# Altium project ATRACK_HOST_V1.PrjPCB
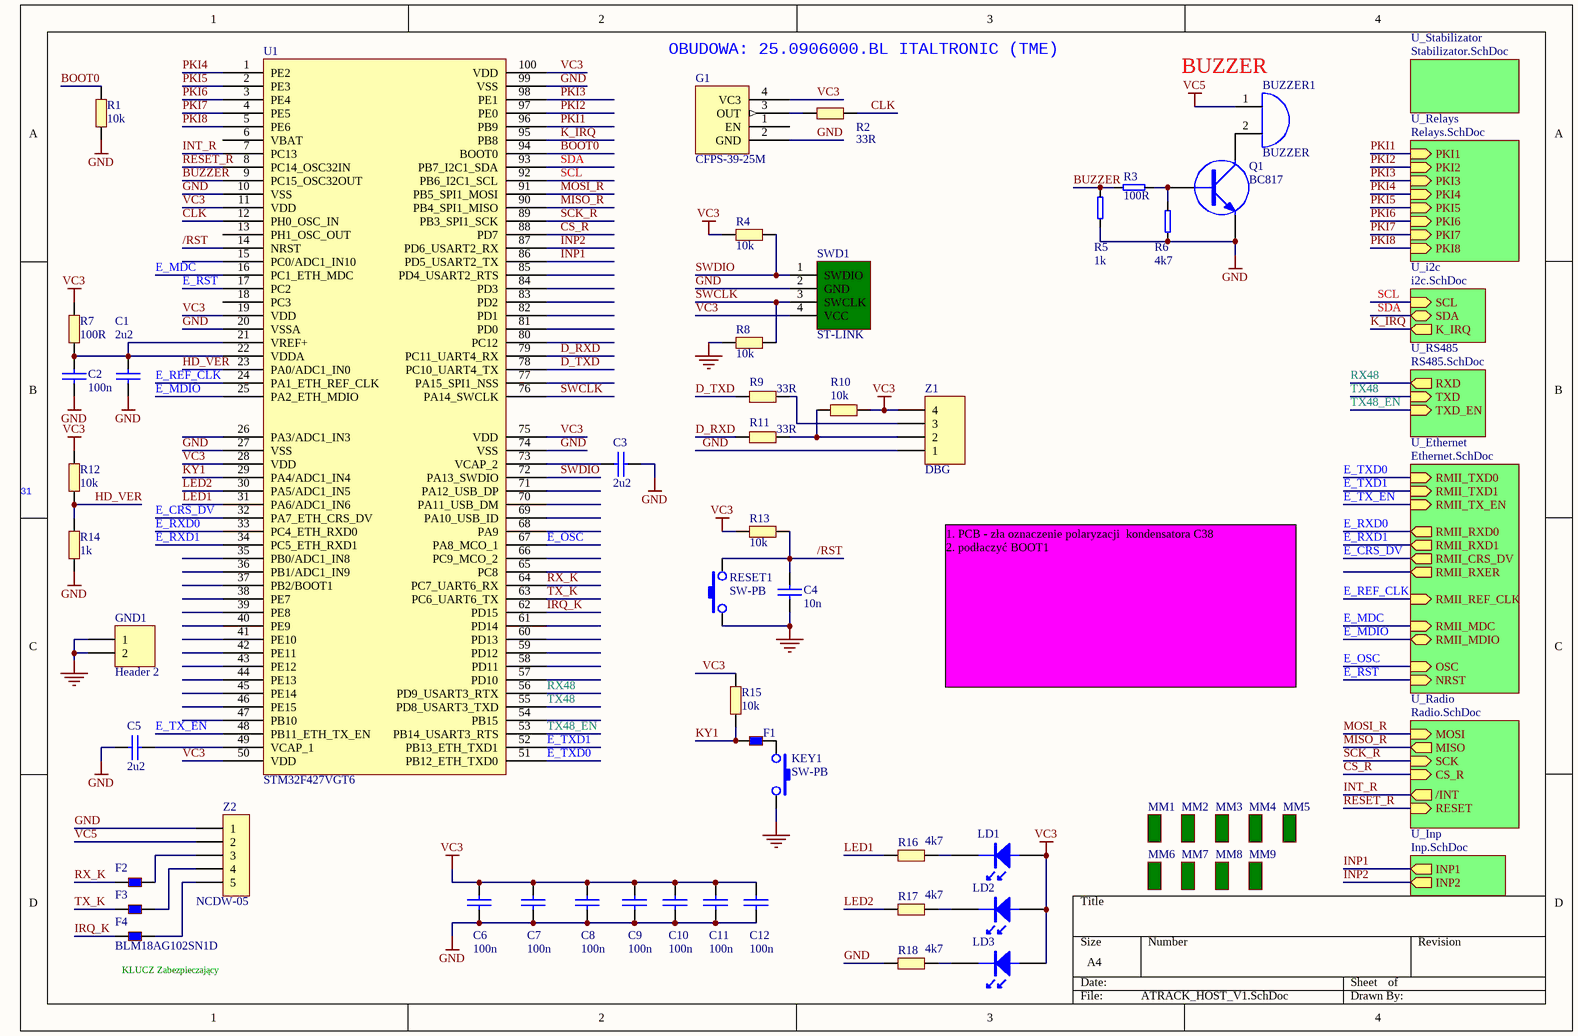
[diagram p0: ATRACK_HOST_V1.SchDoc]
8 sheets, 274 parts. Net scope: hierarchical (ports join the sheet entries above them; power ports are global).
Board file: ATRACK_HOST_V1.PcbDoc
Sheets:
  ATRACK_HOST_V1.SchDoc
    U_Stabilizator = Stabilizator.SchDoc
    U_Ethernet = Ethernet.SchDoc
    U_i2c = i2c.SchDoc
    U_Relays = Relays.SchDoc
    U_RS485 = RS485.SchDoc
    U_Radio = Radio.SchDoc
    U_Inp = Inp.SchDoc

## Sheet ATRACK_HOST_V1.SchDoc
size A4

### Parts
BUZZER1  BUZZER  [BMT-1205H09B]
C1  2u2  [0603C]
C2  100n  [0603C]
C3  2u2  [0603C]
C4  10n  [0603C]
C5  2u2  [0603C]
C6  100n  [0603C]
C7  100n  [0603C]
C8  100n  [0603C]
C9  100n  [0603C]
C10  100n  [0603C]
C11  100n  [0603C]
C12  100n  [0603C]
F1  BLM18BB141SN1D  [0603L]  (value not drawn)
F2  BLM18AG102SN1D  [0603L]  (value not drawn)
F3  BLM18AG102SN1D  [0603L]  (value not drawn)
F4  BLM18AG102SN1D  [0603L]
G1  CFPS-39-25M  [GEN_SMD1_1]
GND1  Header 2  [HDR1X2]
KEY1  SW-PB  [DTSM31N_2]
LD1  (no value)  [0805LG]
LD2  (no value)  [0805LR]
LD3  (no value)  [0805LG]
MM1  (no value)  [REF_CIR]
MM2  (no value)  [REF_CIR]
MM3  (no value)  [REF_SQR]
MM4  (no value)  [REF_SQR]
MM5  (no value)  [PB_FREE_GRAF]
MM6  (no value)  [REF_CIR]
MM7  (no value)  [REF_CIR]
MM8  (no value)  [REF_SQR]
MM9  (no value)  [REF_SQR]
Q1  BC817  [SOT23-3Q]
R1  10k  [0603R]
R2  33R  [0603R]
R3  100R  [0603R]
R4  10k  [0603R]
R5  1k  [0603R]
R6  4k7  [0603R]
R7  100R  [0603R]
R8  10k  [0603R]
R9  33R  [0603R]
R10  10k  [0603R]
R11  33R  [0603R]
R12  10k  [0603R]
R13  10k  [0603R]
R14  1k  [0603R]
R15  10k  [0603R]
R16  4k7  [0603R]
R17  4k7  [0603R]
R18  4k7  [0603R]
RESET1  SW-PB  [DTSM31N_2]
SWD1  ST-LINK  [PIN4]
U1  STM32F427VGT6  [VQ100_2]
Z1  DBG  [PIN4]
Z2  NCDW-05  [KEY_LOG]

### Sub-sheets
U_Ethernet = Ethernet.SchDoc: RMII_TXD0 (in), RMII_TX_EN (in), RMII_RXD0 (out), RMII_REF_CLK (in), RMII_CRS_DV (out), RMII_MDC (in), RMII_MDIO (bidir), NRST (in), RMII_TXD1 (in), RMII_RXD1 (out), RMII_RXER (out), OSC (in)
U_i2c = i2c.SchDoc: SCL (in), SDA (bidir), K_IRQ (out)
U_Inp = Inp.SchDoc: INP1 (out), INP2 (out)
U_Radio = Radio.SchDoc: CS_R (in), MOSI (in), MISO (out), SCK (in), RESET (in), /INT (out)
U_Relays = Relays.SchDoc: PKI1 (in), PKI2 (in), PKI3 (in), PKI4 (in), PKI5 (in), PKI6 (in), PKI7 (in), PKI8 (in)
U_RS485 = RS485.SchDoc: TXD (in), TXD_EN (in), RXD (out)
U_Stabilizator = Stabilizator.SchDoc: no entries

### Nets
GND: C1.2 C2.2 C3.1 C4.2 C5.1 C6.2 C7.2 C8.2 C9.2 C10.2 C11.2 C12.2 G1.2(GND) GND1.1 GND1.2 KEY1.2 Q1.E R1.2 R5.2 R6.2 R8.1 R14.1 R18.2 RESET1.1 SWD1.2(GND) U1.10(VSS) U1.20(VSSA) U1.27(VSS) U1.74(VSS) U1.99(VSS) Z1.1 Z2.1
VC3: C6.1 C7.1 C8.1 C9.1 C10.1 C11.1 C12.1 G1.4(VC3) LD1.A LD2.A LD3.A R4.1 R7.2 R10.2 R12.2 R13.1 R15.2 SWD1.4(VCC) U1.11(VDD) U1.19(VDD) U1.28(VDD) U1.50(VDD) U1.75(VDD) U1.100(VDD) Z1.4
VC5: BUZZER1.1 Z2.2
/RST: C4.1 R13.2 RESET1.2 U1.14(NRST)
BOOT0: R1.1 U1.94(BOOT0)
BUZZER: R3.2 R5.1 U1.9(PC15_OSC32OUT)
CLK: R2.2 U1.12(PH0_OSC_IN)
CS_R: U1.88(PD7) ; sheet U_Radio/CS_R
D_RXD: R11.2 U1.79(PC11_UART4_RX)
D_TXD: R9.2 U1.78(PC10_UART4_TX)
E_CRS_DV: U1.32(PA7_ETH_CRS_DV) ; sheet U_Ethernet/RMII_CRS_DV
E_MDC: U1.16(PC1_ETH_MDC) ; sheet U_Ethernet/RMII_MDC
E_MDIO: U1.25(PA2_ETH_MDIO) ; sheet U_Ethernet/RMII_MDIO
E_OSC: U1.67(PA8_MCO_1) ; sheet U_Ethernet/OSC
E_REF_CLK: U1.24(PA1_ETH_REF_CLK) ; sheet U_Ethernet/RMII_REF_CLK
E_RST: U1.17(PC2) ; sheet U_Ethernet/NRST
E_RXD0: U1.33(PC4_ETH_RXD0) ; sheet U_Ethernet/RMII_RXD0
E_RXD1: U1.34(PC5_ETH_RXD1) ; sheet U_Ethernet/RMII_RXD1
E_TX_EN: U1.48(PB11_ETH_TX_EN) ; sheet U_Ethernet/RMII_TX_EN
E_TXD0: U1.51(PB12_ETH_TXD0) ; sheet U_Ethernet/RMII_TXD0
E_TXD1: U1.52(PB13_ETH_TXD1) ; sheet U_Ethernet/RMII_TXD1
HD_VER: R12.1 R14.2 U1.23(PA0/ADC1_IN0)
INP1: U1.86(PD5_USART2_TX) ; sheet U_Inp/INP1
INP2: U1.87(PD6_USART2_RX) ; sheet U_Inp/INP2
INT_R: U1.7(PC13) ; sheet U_Radio//INT
IRQ_K: F4.1 U1.62(PD15)
K_IRQ: U1.95(PB8) ; sheet U_i2c/K_IRQ
KY1: F1.2 R15.1 U1.29(PA4/ADC1_IN4)
LED1: R16.2 U1.31(PA6/ADC1_IN6)
LED2: R17.2 U1.30(PA5/ADC1_IN5)
MISO_R: U1.90(PB4_SPI1_MISO) ; sheet U_Radio/MISO
MOSI_R: U1.91(PB5_SPI1_MOSI) ; sheet U_Radio/MOSI
PKI1: U1.96(PB9) ; sheet U_Relays/PKI1  [project net PK1_1]
PKI2: U1.97(PE0) ; sheet U_Relays/PKI2  [project net PK2_1]
PKI3: U1.98(PE1) ; sheet U_Relays/PKI3  [project net PK3_1]
PKI4: U1.1(PE2) ; sheet U_Relays/PKI4  [project net PK4_1]
PKI5: U1.2(PE3) ; sheet U_Relays/PKI5  [project net PK5_1]
PKI6: U1.3(PE4) ; sheet U_Relays/PKI6  [project net PK6_1]
PKI7: U1.4(PE5) ; sheet U_Relays/PKI7  [project net PK7_1]
PKI8: U1.5(PE6) ; sheet U_Relays/PKI8  [project net PK8_1]
RESET_R: U1.8(PC14_OSC32IN) ; sheet U_Radio/RESET
RX48: U1.56(PD9_USART3_RTX) ; sheet U_RS485/RXD
RX_K: F2.1 U1.64(PC7_UART6_RX)
SCK_R: U1.89(PB3_SPI1_SCK) ; sheet U_Radio/SCK
SCL: U1.92(PB6_I2C1_SCL) ; sheet U_i2c/SCL
SDA: U1.93(PB7_I2C1_SDA) ; sheet U_i2c/SDA
SWCLK: R8.2 SWD1.3(SWCLK) U1.76(PA14_SWCLK)
SWDIO: R4.2 SWD1.1(SWDIO) U1.72(PA13_SWDIO)
TX48: U1.55(PD8_USART3_TXD) ; sheet U_RS485/TXD
TX48_EN: U1.53(PB14_USART3_RTS) ; sheet U_RS485/TXD_EN
TX_K: F3.1 U1.63(PC6_UART6_TX)
NetBUZZER1_2: BUZZER1.2 Q1.C
NetC1_1: C1.1 C2.1 R7.1 U1.21(VREF+) U1.22(VDDA)
NetC3_2: C3.2 U1.73(VCAP_2)
NetC5_2: C5.2 U1.49(VCAP_1)
NetF1_1: F1.1 KEY1.1
NetF2_2: F2.2 Z2.3
NetF3_2: F3.2 Z2.4
NetF4_2: F4.2 Z2.5
NetG1_3: G1.3(OUT) R2.1
NetLD1_K: LD1.K R16.1
NetLD2_K: LD2.K R17.1
NetLD3_K: LD3.K R18.1
NetQ1_B: Q1.B R3.1 R6.1
NetR9_1: R9.1 Z1.3
NetR10_1: R10.1 R11.1 Z1.2

Not connected (* = marked no-connect by the designer): G1 1(EN); U1 6(VBAT) 13(PH1_OSC_OUT) 15(PC0/ADC1_IN10) 18(PC3) 26(PA3/ADC1_IN3) 35(PB0/ADC1_IN8) 36(PB1/ADC1_IN9) 37(PB2/BOOT1) 38(PE7) 39(PE8) 40(PE9) 41(PE10) 42(PE11) 43(PE12) 44(PE13) 45(PE14) 46(PE15) 47(PB10) 54(PB15) 57(PD10) 58(PD11) 59(PD12) 60(PD13) 61(PD14) 65(PC8) 66(PC9_MCO_2) 68(PA9) 69(PA10_USB_ID) 70(PA11_USB_DM) 71(PA12_USB_DP) 77(PA15_SPI1_NSS) 80(PC12) 81(PD0) 82(PD1) 83(PD2) 84(PD3) 85(PD4_USART2_RTS)

### Notes on the sheet
- OBUDOWA: 25.0906000.BL ITALTRONIC (TME)
- (near BUZZER1) BUZZER
- 31
- 1. PCB - zła oznaczenie polaryzacji  kondensatora C38
  2. podłaczyć BOOT1
- (near F4) KLUCZ Zabezpieczający

### Library data of the parts
C1-C12 = CAP: Capacitor
F1-F4 = KORALIK: Koralik ferrytowy
G1 = GENER_SMD
GND1 = Header 2: Header, 2-Pin; LatestRevisionDate: 17-Jul-2002; LatestRevisionNote: Re-released for DXP Platform.; Publisher: Altium Limited
LD1-LD3 = LED
MM1-MM9 = MECH
Q1 = NPN-SOT23: NPN Transistor
R1 R2 R4 R7-R18 = RES3
R3 R5 R6 = R
SWD1 = SW_CON: Header, 4-Pin; LatestRevisionDate: 17-Jul-2002; LatestRevisionNote: Re-released for DXP Platform.; Publisher: Altium Limited
U1 = STM32F427_LQFP100
Z1 = Header 4: Header, 4-Pin; LatestRevisionDate: 17-Jul-2002; LatestRevisionNote: Re-released for DXP Platform.; Publisher: Altium Limited
Z2 = CON5: Connector

## Sheet Stabilizator.SchDoc
size A4
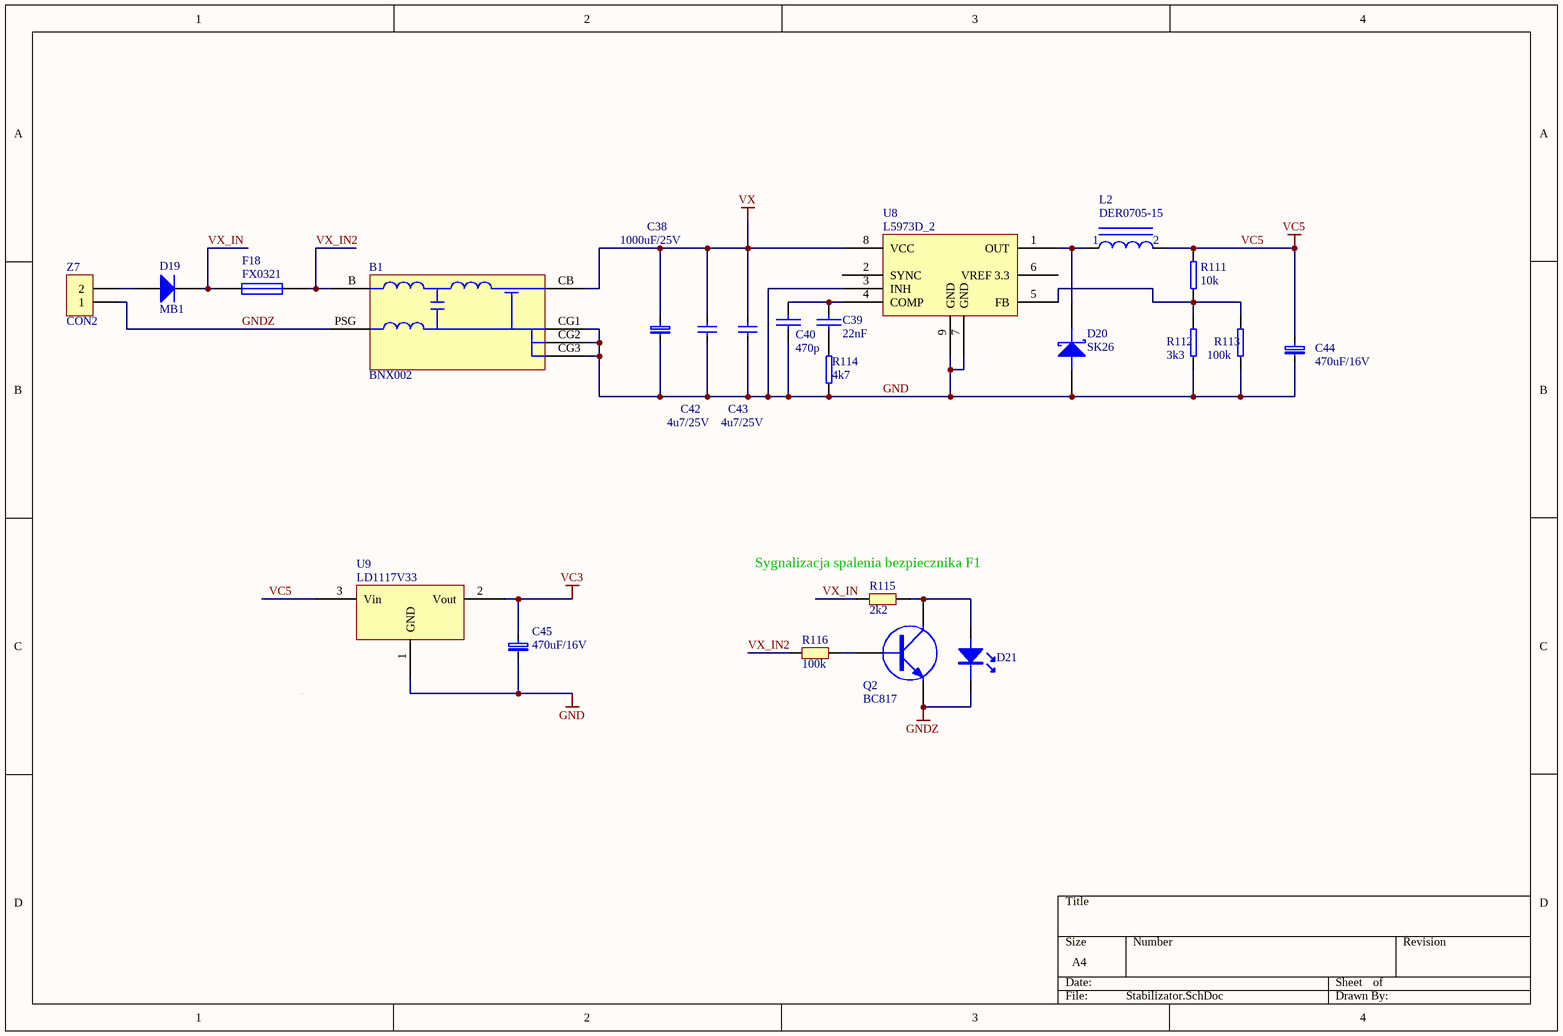
[diagram p1: Stabilizator.SchDoc]

### Parts
B1  BNX002  [BNX002]
C38  1000uF/25V  [RB-.2/.4]
C39  22nF  [0603C]
C40  470p  [0603C]
C42  4u7/25V  [1206]
C43  4u7/25V  [1206]
C44  470uF/16V  [CAP_D]
C45  470uF/16V  [CAP_D]
D19  MB1  [RD5]
D20  SK26  [RD5]
D21  LED1  [0805LR]  (value not drawn)
F18  FX0321  [FX300]
L2  DER0705-15  [DER0705_1]
Q2  BC817  [SOT23-3Q]
R111  10k  [0603R]
R112  3k3  [0603R]
R113  100k  [0603R]
R114  4k7  [0603R]
R115  2k2  [0603R]
R116  100k  [0603R]
U8  L5973D_2  [SO8_M]
U9  LD1117V33  [DPAK]
Z7  CON2  [ARC-2-5.08-A1]

### Nets
GND: B1.CG1 B1.CG2 B1.CG3 C38.1 C40.2 C42.1 C43.1 C44.1 C45.1 D20.A R112.2 R113.2 R114.2 U8.3(INH) U8.7(GND) U8.9(GND) U9.1(GND)
GNDZ: B1.PSG D21.K Q2.E Z7.1
VC3: C45.2 U9.2(Vout)
VC5: C44.2 L2.2 R111.1 U9.3(Vin)
VX: B1.CB C38.2 C42.2 C43.2 U8.8(VCC)
VX_IN: D19.K F18.1 R115.2
VX_IN2: B1.B F18.2 R116.2
NetC39_1: C39.1 R114.1
NetC39_2: C39.2 C40.1 U8.4(COMP)
NetD19_A: D19.A Z7.2
NetD20_K: D20.K L2.1 U8.1(OUT)
NetD21_A: D21.A Q2.C R115.1
NetQ2_B: Q2.B R116.1
NetR111_2: R111.2 R112.1 R113.1 U8.5(FB)

Not connected (* = marked no-connect by the designer): U8 2(SYNC) 6(VREF_3.3)

### Notes on the sheet
- (near R115) Sygnalizacja spalenia bezpiecznika F1

### Library data of the parts
C38 C44 C45 = CAP_TANTAL_SMD: KONDENSATOR ELEKTROLITYCZNY TANTALOWY SMD
C39 C40 = CAP: Capacitor
C42 C43 = CAP
D19 = Diode: Default Diode; Published: 8-Jun-2000; LatestRevisionDate: 17-Jul-2002; LatestRevisionNote: Re-released for DXP Platform.; PackageVersion: Sep-1996; PackageReference: SMC; Publisher: Altium Limited; PackageDescription: DO-214-AB/SMC; 2 C-Bend Leads; Body 7.9 x 5.9 mm, inc. leads (LxW); Code_JEDEC: DO-214-AB
D20 = DIODE SCHOTTKY: Schottky Diode
F18 = FUSE1: Fuse
L2 = CEWKA_1
Q2 = NPN-SOT23: NPN Transistor
R111-R116 = RES3
Z7 = CON2: Connector

## Sheet Ethernet.SchDoc
size A4
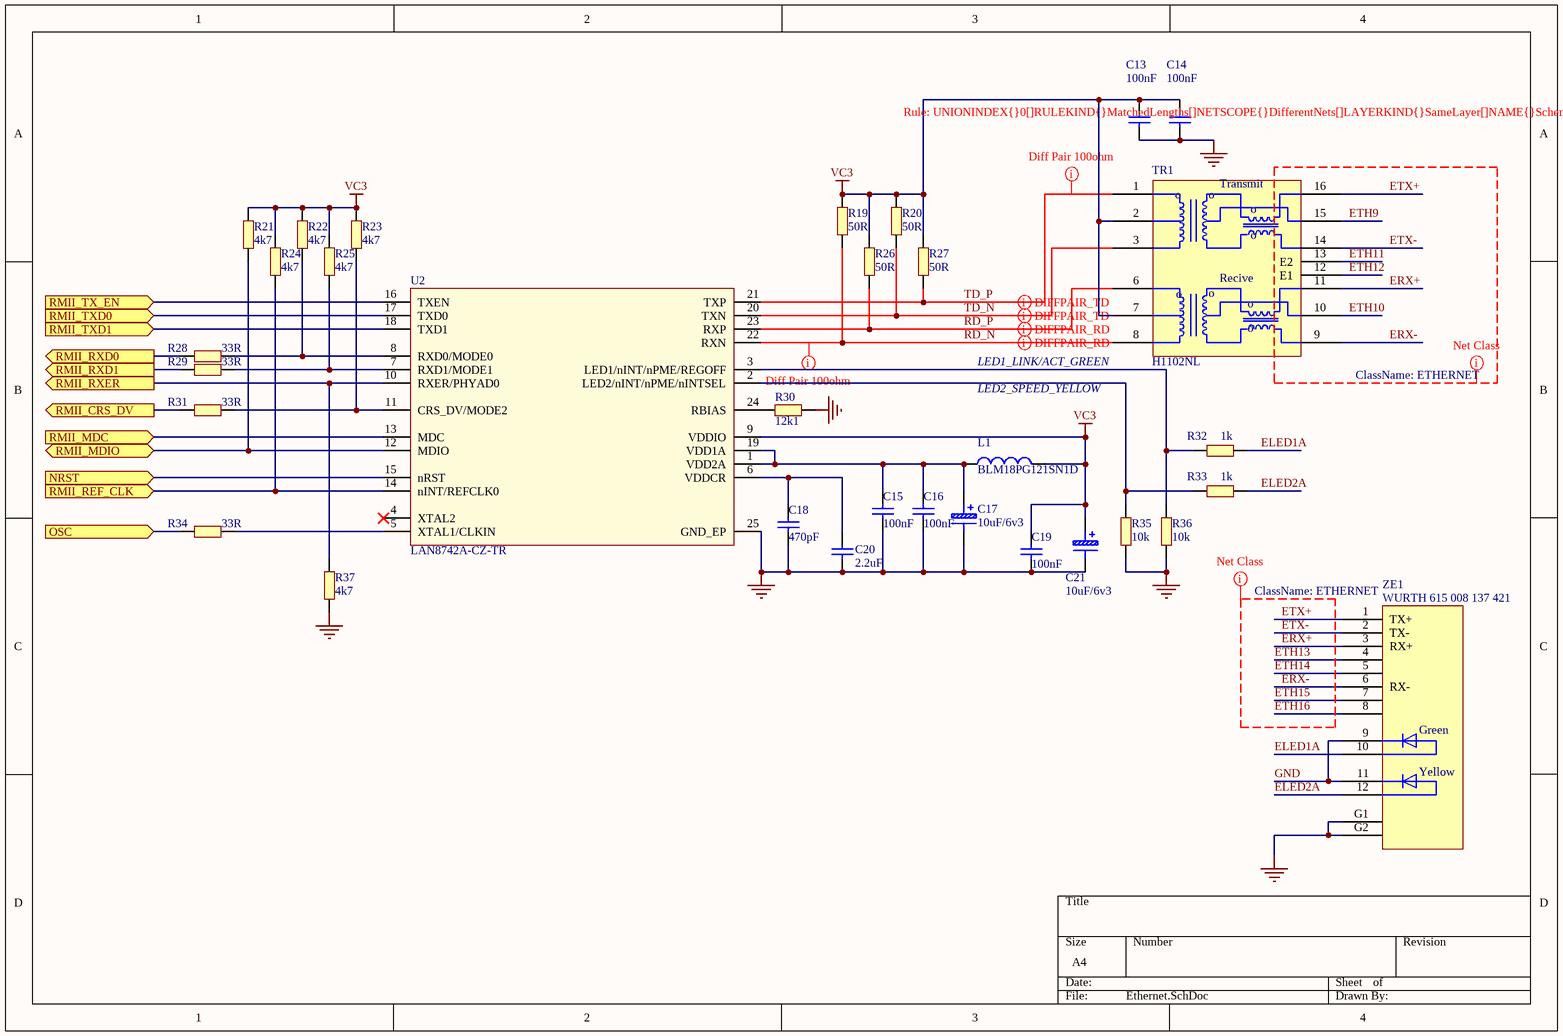
[diagram p2: Ethernet.SchDoc]

### Parts
C13  100nF  [0603C]
C14  100nF  [0603C]
C15  100nF  [0603C]
C16  100nF  [0603C]
C17  10uF/6v3  [CAP_A]
C18  470pF  [0603C]
C19  100nF  [0603C]
C20  2.2uF  [0603C]
C21  10uF/6v3  [CAP_A]
L1  BLM18PG121SN1D  [0603L]
R19  50R  [0603R]
R20  50R  [0603R]
R21  4k7  [0603R]
R22  4k7  [0603R]
R23  4k7  [0603R]
R24  4k7  [0603R]
R25  4k7  [0603R]
R26  50R  [0603R]
R27  50R  [0603R]
R28  33R  [0603R]
R29  33R  [0603R]
R30  12k1  [0603R]
R31  33R  [0603R]
R32  1k  [0603R]
R33  1k  [0603R]
R34  33R  [0603R]
R35  10k  [0603R]
R36  10k  [0603R]
R37  4k7  [0603R]
TR1  H1102NL  [H1102]
U2  LAN8742A-CZ-TR  [QFN24_LAN]
ZE1  WURTH 615 008 137 421  [RJ45GELED]

### Ports
NRST (in), OSC (in), RMII_CRS_DV (out), RMII_MDC (in), RMII_MDIO (bidir), RMII_REF_CLK (in), RMII_RXD0 (out), RMII_RXD1 (out), RMII_RXER (out), RMII_TX_EN (in), RMII_TXD0 (in), RMII_TXD1 (in)

### Nets
GND: C13.1 C14.1 C15.1 C16.1 C17.1 C18.1 C19.1 C20.1 C21.1 R30.1 R35.1 R36.1 R37.1 U2.25(GND_EP) ZE1.9 ZE1.11 ZE1.G1 ZE1.G2
VC3: C13.2 C14.2 C19.2 C21.2 L1.2 R19.2 R20.2 R21.2 R22.1 R23.1 R24.2 R25.1 R26.2 R27.2 TR1.2(TI2) TR1.7(RI2) U2.9(VDDIO)
E_CRS_DV: R31.1 ; port RMII_CRS_DV
E_MDC: U2.13(MDC) ; port RMII_MDC
E_MDIO: R21.1 U2.12(MDIO) ; port RMII_MDIO
E_OSC: R34.1 ; port OSC
E_REF_CLK: R24.1 U2.14(nINT/REFCLK0) ; port RMII_REF_CLK
E_RST: U2.15(nRST) ; port NRST
E_RXD0: R28.1 ; port RMII_RXD0
E_RXD1: R29.1 ; port RMII_RXD1
E_TX_EN: U2.16(TXEN) ; port RMII_TX_EN
E_TXD0: U2.17(TXD0) ; port RMII_TXD0
E_TXD1: U2.18(TXD1) ; port RMII_TXD1
ELED1A: R32.1 ZE1.10
ELED2A: R33.1 ZE1.12
ERX+: TR1.11(RO1) ZE1.3(RX+)
ERX-: TR1.9(RO2) ZE1.6(RX-)
ETH9: TR1.15
ETH10: TR1.10
ETH11: TR1.13(E2)
ETH12: TR1.12(E1)
ETH13: ZE1.4
ETH14: ZE1.5
ETH15: ZE1.7
ETH16: ZE1.8
ETX+: TR1.16(TO1) ZE1.1(TX+)
ETX-: TR1.14(TO2) ZE1.2(TX-)
RD_N: R19.1 TR1.8(RI3) U2.22(RXN)
RD_P: R26.1 TR1.6(RI1) U2.23(RXP)
TD_N: R20.1 TR1.3(TI3) U2.20(TXN)
TD_P: R27.1 TR1.1(TI1) U2.21(TXP)
NetC15_2: C15.2 C16.2 C17.2 L1.1 U2.1(VDD2A) U2.19(VDD1A)
NetC18_2: C18.2 C20.2 U2.6(VDDCR)
NetR22_2: R22.2 R28.2 U2.8(RXD0/MODE0)
NetR23_2: R23.2 R31.2 U2.11(CRS_DV/MODE2)
NetR25_2: R25.2 R29.2 U2.7(RXD1/MODE1)
NetR30_2: R30.2 U2.24(RBIAS)
NetR32_2: R32.2 R36.2 U2.3(LED1/nINT/nPME/REGOFF)
NetR33_2: R33.2 R35.2 U2.2(LED2/nINT/nPME/nINTSEL)
NetR34_2: R34.2 U2.5(XTAL1/CLKIN)
NetR37_2: R37.2 U2.10(RXER/PHYAD0) ; port RMII_RXER

Not connected (* = marked no-connect by the designer): U2 4(XTAL2)*

### Layout directives
differential pair: RD_N, RD_P, TD_N, TD_P
rule Matched Net Lengths [Tolerance = 300mil]: RD_N, TD_P
net class ETHERNET: ERX+, ERX-, ETH9, ETH10, ETH11, ETH12, ETH13, ETH14, ETH15, ETH16, ETX+, ETX-

### Notes on the sheet
- LED1_LINK/ACT_GREEN
- LED2_SPEED_YELLOW
- (in symbol H1102NL) Transmit; o; Recive
- (in symbol RJ45GELED) Green; Yellow

### Library data of the parts
C13-C16 C19 = Cap_100nF_X7R_10%_0402: Capacitor,100nF,16V,X7R,10%,0402,YAGEO; Manuf_Part_1: CC0402KRX7R7BB104; Revision: July-2002: Re-released for DXP Platform.; Value: 100nF; Order: CC0402KRX7R7BB104; Manuf_1: YAGEO
C17 C21 = CapTantal
C18 = Cap_470pF_X7R_10%_0402: Capacitor,470pF,16V,X7R,10%,0402,YAGEO; Manuf_Part_1: 0402YC471KAT4A; Revision: July-2002: Re-released for DXP Platform.; Value: 470pF; Order: 0402YC471KAT4A; Manuf_1: YAGEO; ECCN_US/EU: n/a
C20 = Cap_1uF_X5R_10%_0603: Capacitor,1uF,16V,X5R,10%,0603,YAGEO; Manuf_Part_1: CC0603KRX5R7BB105; Revision: July-2002: Re-released for DXP Platform.; Value: 1uF; Order: CC0603KRX5R7BB105; Manuf_1: YAGEO; ECCN_US/EU: n/a
L1 = BEAD_120R_2A_0603: Bead,120R,2A,0603,BLM18PG121SN1D,MURATA; Manuf_Part_3: FCM1608KF-601T03; Manuf_2: TDK; Manuf_Part_2: MPZ1608S300A; Manuf_3: Tai-tech; Value: 100uH; Description_3: Bead,600R,350mA,0603,FCM1608KF-601T03,Tai-tech; Description_2: Bead,30R,5A,0603,MPZ1608S300A,TDK; Revision: July-2002: Re-released for DXP Platform.; ECCN_US/EU: n/a; Manuf_Part_1: BLM18PG121SN1D; Manuf_1: MURATA
R19-R37 = RES3
TR1 = H1102NL: Dostawca.Symbol: 749010310; Dostawca: WURTH
U2 = LAN8742A-CZ-TR: LAN8742A-CZ-TR - Small Footprint RMII 10/100 Ethernet, Transceiver with HP Auto-MDIX and flexPWR Technology SQFN-24; Manuf_1: MICROCHIP; Dostawca.Symbol: 579-LAN8742A-CZ; Dostawca: Mouser; Order: LAN8742A-CZ-TR; Manuf_Part_1: LAN8742A-CZ-TR; Distrib: MICROCHIP
ZE1 = RJ45GELED

## Sheet i2c.SchDoc
size A4
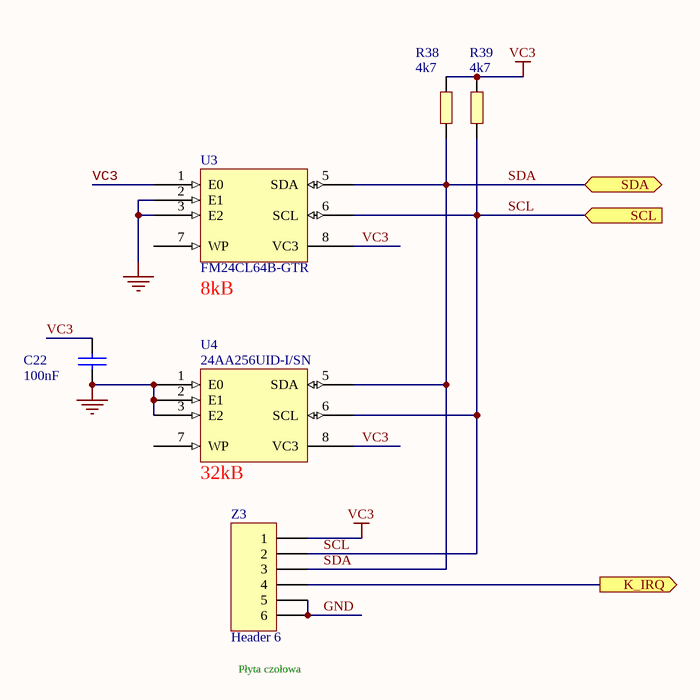
[diagram p3: i2c.SchDoc]

### Parts
C22  100nF  [0603C]
R38  4k7  [0603R]
R39  4k7  [0603R]
U3  FM24CL64B-GTR  [SO8]
U4  24AA256UID-I/SN  [SO8]
Z3  Header 6  [UMATCH-6SMD]

### Ports
K_IRQ (out), SCL (in), SDA (bidir)

### Nets
GND: C22.2 U3.2(E1) U3.3(E2) U3.4(GND) U4.1(E0) U4.2(E1) U4.3(E2) U4.4(GND) Z3.5 Z3.6
VC3: C22.1 R38.1 R39.1 U3.1(E0) U3.8(VC3) U4.8(VC3) Z3.1
K_IRQ: Z3.4 ; port K_IRQ
SCL: R39.2 U3.6(SCL) U4.6(SCL) Z3.2 ; port SCL
SDA: R38.2 U3.5(SDA) U4.5(SDA) Z3.3 ; port SDA

Not connected (* = marked no-connect by the designer): U3 7(WP); U4 7(WP)

### Notes on the sheet
- (near U3) 8kB
- (near U4) 32kB
- (near Z3) Płyta czołowa

### Library data of the parts
C22 = CAP: Capacitor
R38 R39 = RES3
U3 U4 = AT24C02
Z3 = Header 6: Micro Match 6; Dostawca.Symbol: AMP-7-215079-6; Dostawca: TME; LatestRevisionDate: 17-Jul-2002; LatestRevisionNote: Re-released for DXP Platform.; Publisher: Altium Limited

## Sheet Relays.SchDoc
size A3 portrait
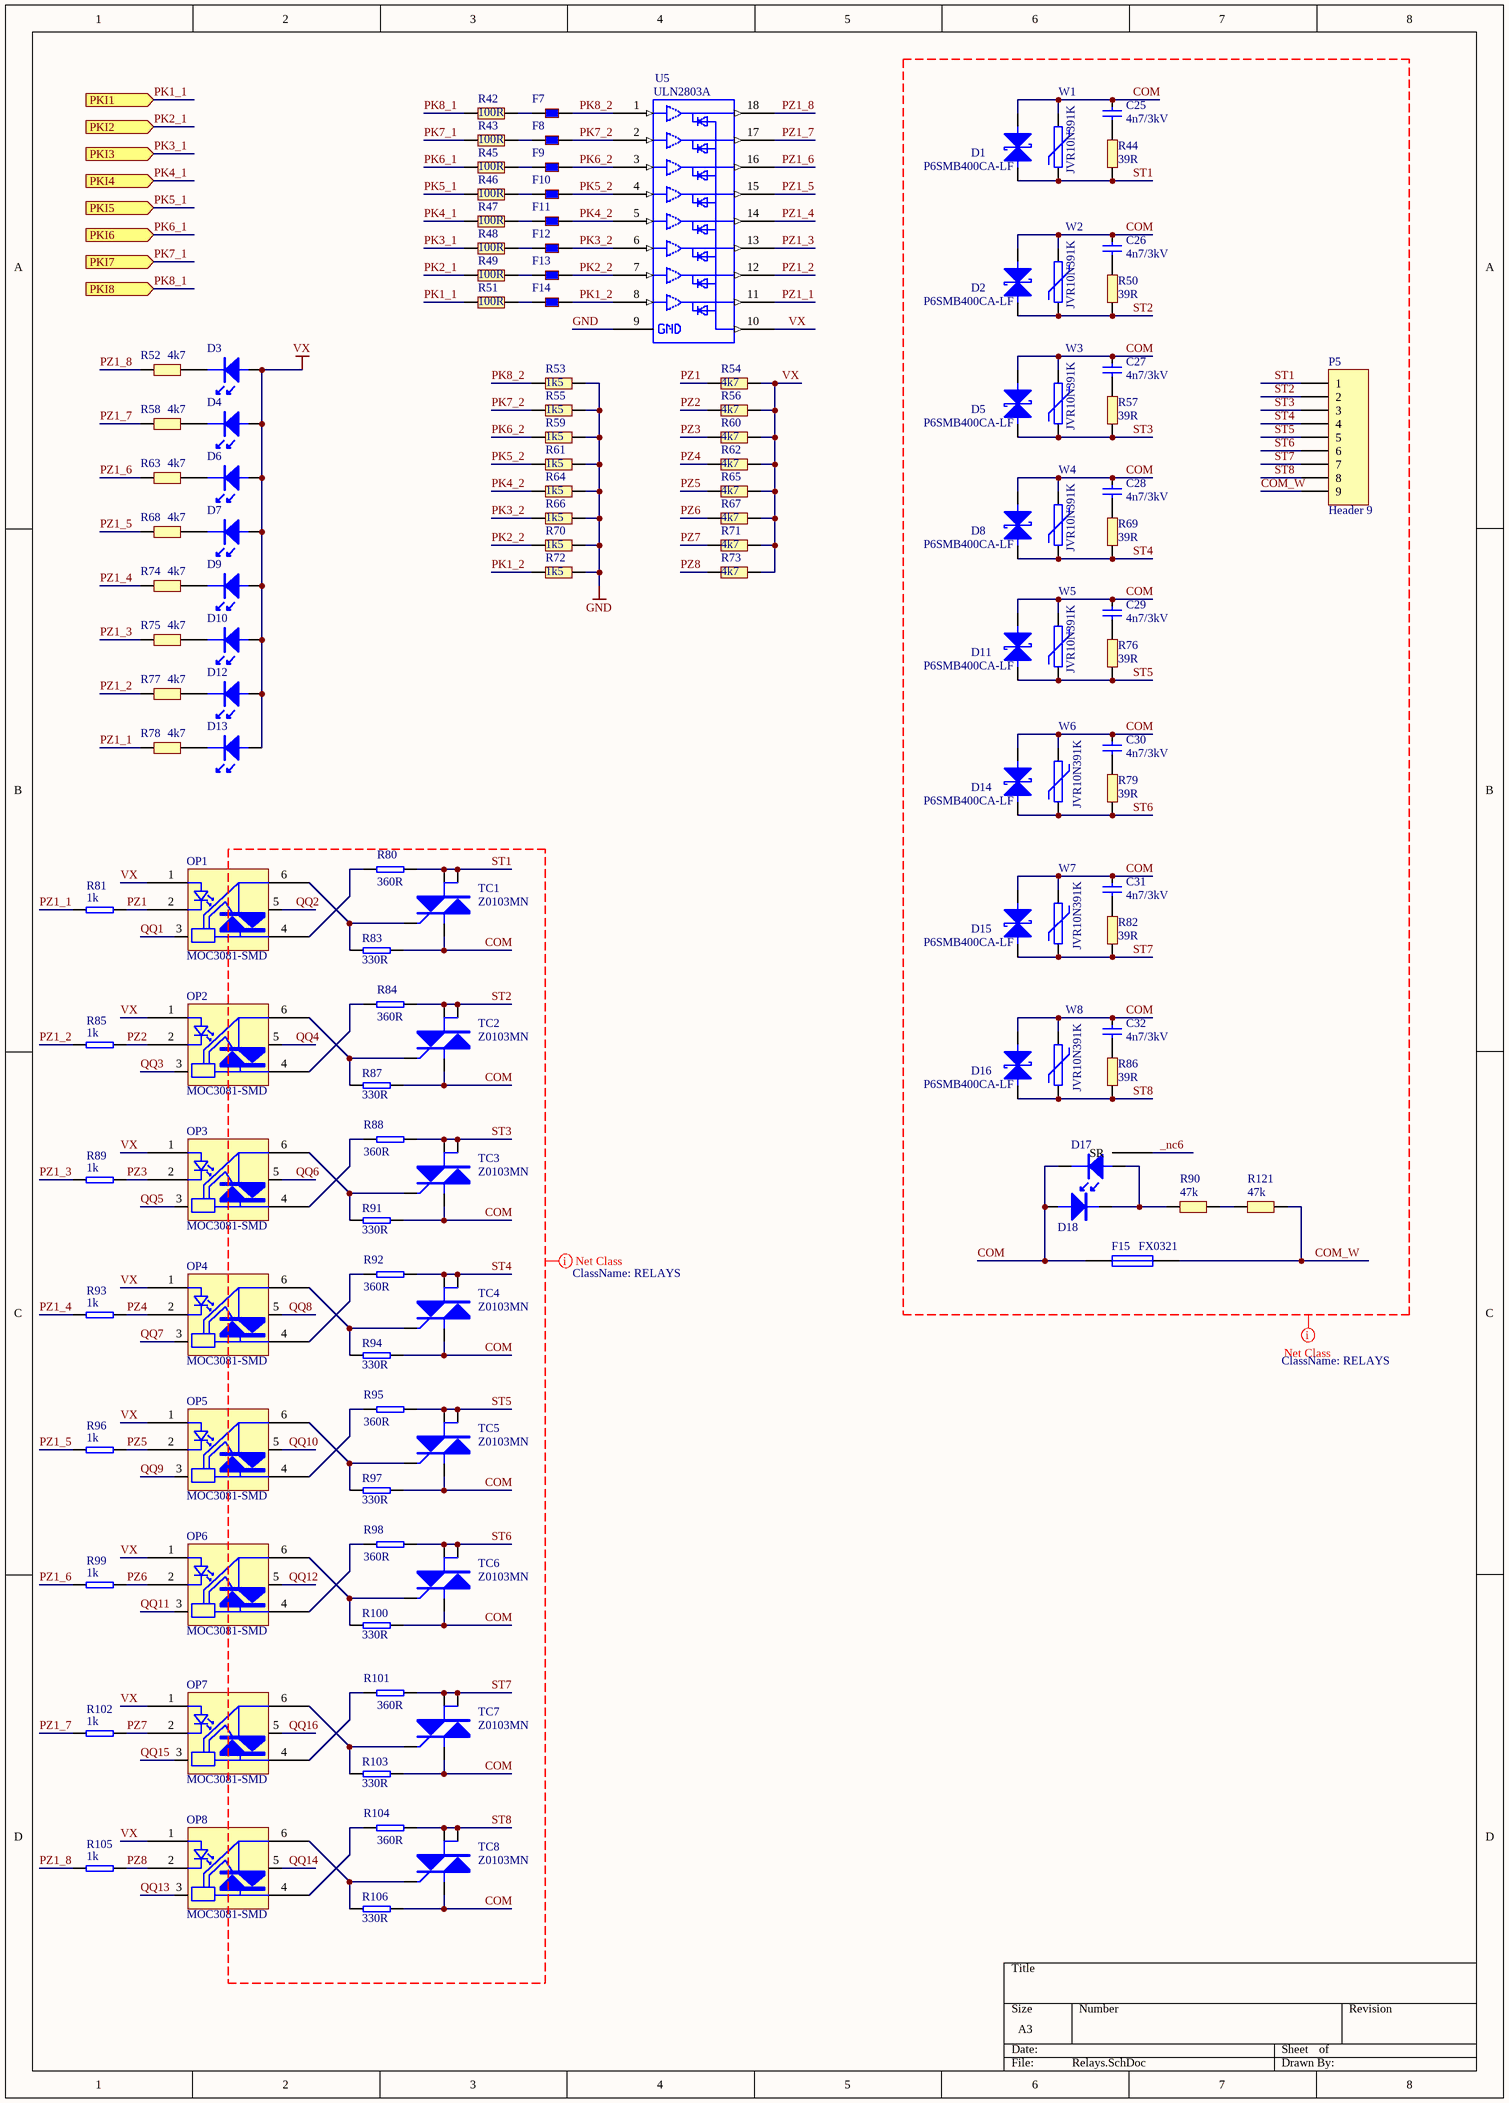
[diagram p4: Relays.SchDoc]

### Parts
C25  4n7/3kV  [CAP_75]
C26  4n7/3kV  [CAP_75]
C27  4n7/3kV  [CAP_75]
C28  4n7/3kV  [CAP_75]
C29  4n7/3kV  [CAP_75]
C30  4n7/3kV  [CAP_75]
C31  4n7/3kV  [CAP_75]
C32  4n7/3kV  [CAP_75]
D1  P6SMB400CA-LF  [RD5_U]
D2  P6SMB400CA-LF  [RD5_U]
D3  LED1  [0805LB]  (value not drawn)
D4  LED1  [0805LB]  (value not drawn)
D5  P6SMB400CA-LF  [RD5_U]
D6  LED1  [0805LB]  (value not drawn)
D7  LED1  [0805LB]  (value not drawn)
D8  P6SMB400CA-LF  [RD5_U]
D9  LED1  [0805LB]  (value not drawn)
D10  LED1  [0805LB]  (value not drawn)
D11  P6SMB400CA-LF  [RD5_U]
D12  LED1  [0805LB]  (value not drawn)
D13  LED1  [0805LB]  (value not drawn)
D14  P6SMB400CA-LF  [RD5_U]
D15  P6SMB400CA-LF  [RD5_U]
D16  P6SMB400CA-LF  [RD5_U]
D17  LED1  [LED_LAMP_1]  (value not drawn)
D18  1N4148-0805  [0805D]  (value not drawn)
F7  BLM18AG102SN1D  [0603L]  (value not drawn)
F8  BLM18AG102SN1D  [0603L]  (value not drawn)
F9  BLM18AG102SN1D  [0603L]  (value not drawn)
F10  BLM18AG102SN1D  [0603L]  (value not drawn)
F11  BLM18AG102SN1D  [0603L]  (value not drawn)
F12  BLM18AG102SN1D  [0603L]  (value not drawn)
F13  BLM18AG102SN1D  [0603L]  (value not drawn)
F14  BLM18AG102SN1D  [0603L]  (value not drawn)
F15  FX0321  [FX300]
OP1  MOC3081-SMD  [SMD6-OP]
OP2  MOC3081-SMD  [SMD6-OP]
OP3  MOC3081-SMD  [SMD6-OP]
OP4  MOC3081-SMD  [SMD6-OP]
OP5  MOC3081-SMD  [SMD6-OP]
OP6  MOC3081-SMD  [SMD6-OP]
OP7  MOC3081-SMD  [SMD6-OP]
OP8  MOC3081-SMD  [SMD6-OP]
P5  Header 9  [ARC-9-5.08]
R42  100R  [0603R]
R43  100R  [0603R]
R44  39R  [1206]
R45  100R  [0603R]
R46  100R  [0603R]
R47  100R  [0603R]
R48  100R  [0603R]
R49  100R  [0603R]
R50  39R  [1206]
R51  100R  [0603R]
R52  4k7  [0603R]
R53  1k5  [0603R]
R54  4k7  [0603R]
R55  1k5  [0603R]
R56  4k7  [0603R]
R57  39R  [1206]
R58  4k7  [0603R]
R59  1k5  [0603R]
R60  4k7  [0603R]
R61  1k5  [0603R]
R62  4k7  [0603R]
R63  4k7  [0603R]
R64  1k5  [0603R]
R65  4k7  [0603R]
R66  1k5  [0603R]
R67  4k7  [0603R]
R68  4k7  [0603R]
R69  39R  [1206]
R70  1k5  [0603R]
R71  4k7  [0603R]
R72  1k5  [0603R]
R73  4k7  [0603R]
R74  4k7  [0603R]
R75  4k7  [0603R]
R76  39R  [1206]
R77  4k7  [0603R]
R78  4k7  [0603R]
R79  39R  [1206]
R80  360R  [0805R]
R81  1k  [0603R]
R82  39R  [1206]
R83  330R  [0805R]
R84  360R  [0805R]
R85  1k  [0603R]
R86  39R  [1206]
R87  330R  [0805R]
R88  360R  [0805R]
R89  1k  [0603R]
R90  47k  [1206]
R91  330R  [0805R]
R92  360R  [0805R]
R93  1k  [0603R]
R94  330R  [0805R]
R95  360R  [0805R]
R96  1k  [0603R]
R97  330R  [0805R]
R98  360R  [0805R]
R99  1k  [0603R]
R100  330R  [0805R]
R101  360R  [0805R]
R102  1k  [0603R]
R103  330R  [0805R]
R104  360R  [0805R]
R105  1k  [0603R]
R106  330R  [0805R]
R121  47k  [1206]
TC1  Z0103MN  [SOT223]
TC2  Z0103MN  [SOT223]
TC3  Z0103MN  [SOT223]
TC4  Z0103MN  [SOT223]
TC5  Z0103MN  [SOT223]
TC6  Z0103MN  [SOT223]
TC7  Z0103MN  [SOT223]
TC8  Z0103MN  [SOT223]
U5  ULN2803A  [SO-18]
W1  JVR10N391K  [CAP_75]
W2  JVR10N391K  [CAP_75]
W3  JVR10N391K  [CAP_75]
W4  JVR10N391K  [CAP_75]
W5  JVR10N391K  [CAP_75]
W6  JVR10N391K  [CAP_75]
W7  JVR10N391K  [CAP_75]
W8  JVR10N391K  [CAP_75]

### Ports
PKI1 (in), PKI2 (in), PKI3 (in), PKI4 (in), PKI5 (in), PKI6 (in), PKI7 (in), PKI8 (in)

### Nets
GND: R53.1 R55.1 R59.1 R61.1 R64.1 R66.1 R70.1 R72.1 U5.9
VX: D3.A D4.A D6.A D7.A D9.A D10.A D12.A D13.A OP1.1 OP2.1 OP3.1 OP4.1 OP5.1 OP6.1 OP7.1 OP8.1 R54.1 R56.1 R60.1 R62.1 R65.1 R67.1 R71.1 R73.1 U5.10
_nc6: D17.0(SR)
COM: C25.2 C26.2 C27.2 C28.2 C29.2 C30.2 C31.2 C32.2 D1.K D2.K D5.K D8.K D11.K D14.K D15.K D16.K D17.K D18.A F15.1 R83.1 R87.1 R91.1 R94.1 R97.1 R100.1 R103.1 R106.1 TC1.1 TC2.1 TC3.1 TC4.1 TC5.1 TC6.1 TC7.1 TC8.1 W1.1 W2.1 W3.1 W4.1 W5.1 W6.1 W7.1 W8.1
COM_W: F15.2 P5.9 R121.1
PK1_1: R51.2 ; port PKI1
PK1_2: F14.2 R72.2 U5.8
PK2_1: R49.2 ; port PKI2
PK2_2: F13.2 R70.2 U5.7
PK3_1: R48.2 ; port PKI3
PK3_2: F12.2 R66.2 U5.6
PK4_1: R47.2 ; port PKI4
PK4_2: F11.2 R64.2 U5.5
PK5_1: R46.2 ; port PKI5
PK5_2: F10.2 R61.2 U5.4
PK6_1: R45.2 ; port PKI6
PK6_2: F9.2 R59.2 U5.3
PK7_1: R43.2 ; port PKI7
PK7_2: F8.2 R55.2 U5.2
PK8_1: R42.2 ; port PKI8
PK8_2: F7.2 R53.2 U5.1
PZ1: OP1.2 R54.2 R81.2
PZ1_1: R78.2 R81.1 U5.11
PZ1_2: R77.2 R85.1 U5.12
PZ1_3: R75.2 R89.1 U5.13
PZ1_4: R74.2 R93.1 U5.14
PZ1_5: R68.2 R96.1 U5.15
PZ1_6: R63.2 R99.1 U5.16
PZ1_7: R58.2 R102.1 U5.17
PZ1_8: R52.2 R105.1 U5.18
PZ2: OP2.2 R56.2 R85.2
PZ3: OP3.2 R60.2 R89.2
PZ4: OP4.2 R62.2 R93.2
PZ5: OP5.2 R65.2 R96.2
PZ6: OP6.2 R67.2 R99.2
PZ7: OP7.2 R71.2 R102.2
PZ8: OP8.2 R73.2 R105.2
QQ1: OP1.3
QQ2: OP1.5
QQ3: OP2.3
QQ4: OP2.5
QQ5: OP3.3
QQ6: OP3.5
QQ7: OP4.3
QQ8: OP4.5
QQ9: OP5.3
QQ10: OP5.5
QQ11: OP6.3
QQ12: OP6.5
QQ13: OP8.3
QQ14: OP8.5
QQ15: OP7.3
QQ16: OP7.5
ST1: D1.A P5.1 R44.1 R80.2 TC1.2 TC1.4 W1.2
ST2: D2.A P5.2 R50.1 R84.2 TC2.2 TC2.4 W2.2
ST3: D5.A P5.3 R57.1 R88.2 TC3.2 TC3.4 W3.2
ST4: D8.A P5.4 R69.1 R92.2 TC4.2 TC4.4 W4.2
ST5: D11.A P5.5 R76.1 R95.2 TC5.2 TC5.4 W5.2
ST6: D14.A P5.6 R79.1 R98.2 TC6.2 TC6.4 W6.2
ST7: D15.A P5.7 R82.1 R101.2 TC7.2 TC7.4 W7.2
ST8: D16.A P5.8 R86.1 R104.2 TC8.2 TC8.4 W8.2
NetC25_1: C25.1 R44.2
NetC26_1: C26.1 R50.2
NetC27_1: C27.1 R57.2
NetC28_1: C28.1 R69.2
NetC29_1: C29.1 R76.2
NetC30_1: C30.1 R79.2
NetC31_1: C31.1 R82.2
NetC32_1: C32.1 R86.2
NetD3_K: D3.K R52.1
NetD4_K: D4.K R58.1
NetD6_K: D6.K R63.1
NetD7_K: D7.K R68.1
NetD9_K: D9.K R74.1
NetD10_K: D10.K R75.1
NetD12_K: D12.K R77.1
NetD13_K: D13.K R78.1
NetD17_A: D17.A D18.K R90.2
NetF7_1: F7.1 R42.1
NetF8_1: F8.1 R43.1
NetF9_1: F9.1 R45.1
NetF10_1: F10.1 R46.1
NetF11_1: F11.1 R47.1
NetF12_1: F12.1 R48.1
NetF13_1: F13.1 R49.1
NetF14_1: F14.1 R51.1
NetOP1_4: OP1.4 R80.1
NetOP1_6: OP1.6 R83.2 TC1.3
NetOP2_4: OP2.4 R84.1
NetOP2_6: OP2.6 R87.2 TC2.3
NetOP3_4: OP3.4 R88.1
NetOP3_6: OP3.6 R91.2 TC3.3
NetOP4_4: OP4.4 R92.1
NetOP4_6: OP4.6 R94.2 TC4.3
NetOP5_4: OP5.4 R95.1
NetOP5_6: OP5.6 R97.2 TC5.3
NetOP6_4: OP6.4 R98.1
NetOP6_6: OP6.6 R100.2 TC6.3
NetOP7_4: OP7.4 R101.1
NetOP7_6: OP7.6 R103.2 TC7.3
NetOP8_4: OP8.4 R104.1
NetOP8_6: OP8.6 R106.2 TC8.3
NetR90_1: R90.1 R121.2

### Layout directives
net class RELAYS: _nc6, COM, COM_W, QQ2, QQ4, QQ6, QQ8, QQ10, QQ12, QQ14, QQ16, ST1, ST2, ST3, ST4, ST5, ST6, ST7, ST8

### Library data of the parts
C25-C32 = CAP
D1 D2 D5 D8 D11 D14-D16 = TRANSIL
D18 = DIODE1: Diode
F7-F14 = KORALIK: Koralik ferrytowy
F15 = FUSE1: Fuse
OP1-OP8 = MOC3041
P5 = Header 9: Header, 9-Pin; LatestRevisionDate: 17-Jul-2002; LatestRevisionNote: Re-released for DXP Platform.; Publisher: Altium Limited
R42-R106 R121 = RES3
U5 = Pro31.tmp_ULN2803A_42
W1-W8 = RES4

## Sheet RS485.SchDoc
size A4
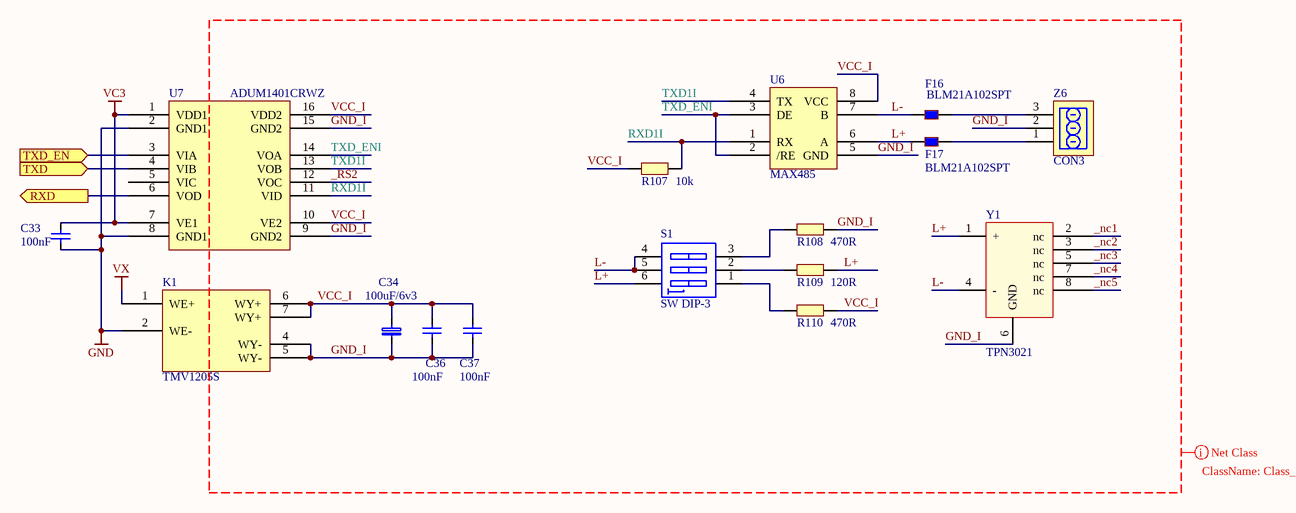
[diagram p5: RS485.SchDoc]

### Parts
C33  100nF  [0603C]
C34  100uF/6v3  [CAP_C]
C36  100nF  [0603C]
C37  100nF  [0603C]
F16  BLM21A102SPT  [0603L]
F17  BLM21A102SPT  [0603L]
K1  TMV1205S  [DCDC-S1_D]
R107  10k  [0603R]
R108  470R  [1206]
R109  120R  [1206]
R110  470R  [1206]
S1  SW DIP-3  [DIP-6]
U6  MAX485  [SO8]
U7  ADUM1401CRWZ  [SMD16B]
Y1  TPN3021  [SO8]
Z6  CON3  [ARC-3-3.5-TYCO-1]

### Ports
RXD (out), TXD (in), TXD_EN (in)

### Nets
GND: C33.2 K1.2(WE-) U7.2(GND1) U7.8(GND1)
VC3: C33.1 U7.1(VDD1) U7.7(VE1)
VX: K1.1(WE+)
_nc1: Y1.2(nc)
_nc2: Y1.3(nc)
_nc3: Y1.5(nc)
_nc4: Y1.7(nc)
_nc5: Y1.8(nc)
_RS2: U7.12(VOC)
GND_I: C34.1 C36.2 C37.2 K1.4(WY-) K1.5(WY-) R108.2 U6.5(GND) U7.9(GND2) U7.15(GND2) Y1.6(GND) Z6.2
L+: F17.1 R109.2 S1.6(B1) U6.6(A) Y1.1(+)
L-: F16.1 S1.4(B3) S1.5(B2) U6.7(B) Y1.4(-)
RX48: U7.6(VOD) ; port RXD
RXD1I: R107.2 U6.1(RX) U7.11(VID)
TX48: U7.4(VIB) ; port TXD
TX48_EN: U7.3(VIA) ; port TXD_EN
TXD1I: U6.4(TX) U7.13(VOB)
TXD_ENI: U6.2(/RE) U6.3(DE) U7.14(VOA)
VCC_I: C34.2 C36.1 C37.1 K1.6(WY+) K1.7(WY+) R107.1 R110.2 U6.8(VCC) U7.10(VE2) U7.16(VDD2)
NetF16_2: F16.2 Z6.3
NetF17_2: F17.2 Z6.1
NetR108_1: R108.1 S1.3(A3)
NetR109_1: R109.1 S1.2(A2)
NetR110_1: R110.1 S1.1(A1)

Not connected (* = marked no-connect by the designer): U7 5(VIC)

### Layout directives
net class Class_RS485: _nc1, _nc2, _nc3, _nc4, _nc5, _RS2, GND_I, L+, L-, RXD1I, TXD1I, TXD_ENI, VCC_I

### Library data of the parts
C33 C36 C37 = CAP
C34 = CAP_TANTAL_SMD: as C38 on sheet Stabilizator
F16 F17 = KORALIK: Koralik ferrytowy
K1 = NMV0505S_D
R107-R110 = RES3
S1 = SW DIP-3: DIP Switch, 3 Position, SPST; Published: 24-Mar-1999; LatestRevisionDate: 17-Jul-2002; LatestRevisionNote: Re-released for DXP Platform.; PackageReference: DIP-6; Publisher: Altium Limited; Code_JEDEC: MO-001-AM
U6 = MAX485_1
U7 = ADUM1401
Z6 = ZL-3

## Sheet Radio.SchDoc
size A4
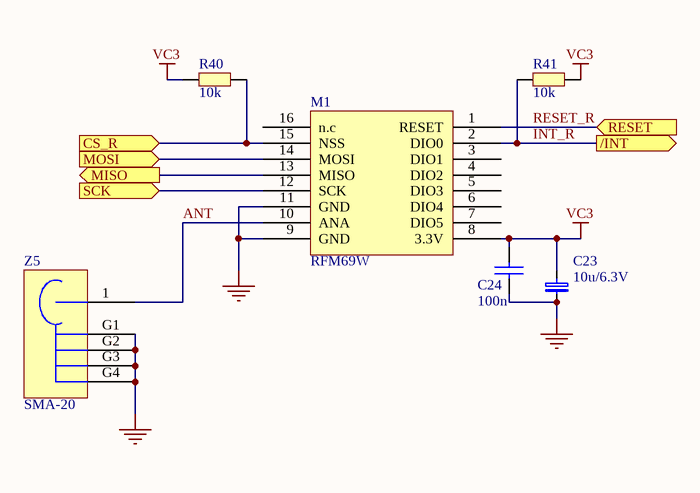
[diagram p6: Radio.SchDoc]

### Parts
C23  10u/6.3V  [CAP_A]
C24  100n  [0603C]
M1  RFM69W  [RFM69W]
R40  10k  [0603R]
R41  10k  [0603R]
Z5  SMA-20  [SMA-20_1]

### Ports
/INT (out), CS_R (in), MISO (out), MOSI (in), RESET (in), SCK (in)

### Nets
GND: C23.1 C24.1 M1.9(GND) M1.11(GND) Z5.G1 Z5.G2 Z5.G3 Z5.G4
VC3: C23.2 C24.2 M1.8(3.3V) R40.2 R41.1
ANT: M1.10(ANA) Z5.1
CS_R: M1.15(NSS) R40.1 ; port CS_R
INT_R: M1.2(DIO0) R41.2 ; port /INT
MISO_R: M1.13(MISO) ; port MISO
MOSI_R: M1.14(MOSI) ; port MOSI
RESET_R: M1.1(RESET) ; port RESET
SCK_R: M1.12(SCK) ; port SCK

Not connected (* = marked no-connect by the designer): M1 3(DIO1) 4(DIO2) 5(DIO3) 6(DIO4) 7(DIO5) 16(n.c)

### Library data of the parts
C23 = CAP_TANTAL_SMD: as C38 on sheet Stabilizator
C24 = CAP: Capacitor
M1 = RFM96W
R40 R41 = RES3

## Sheet Inp.SchDoc
size A4
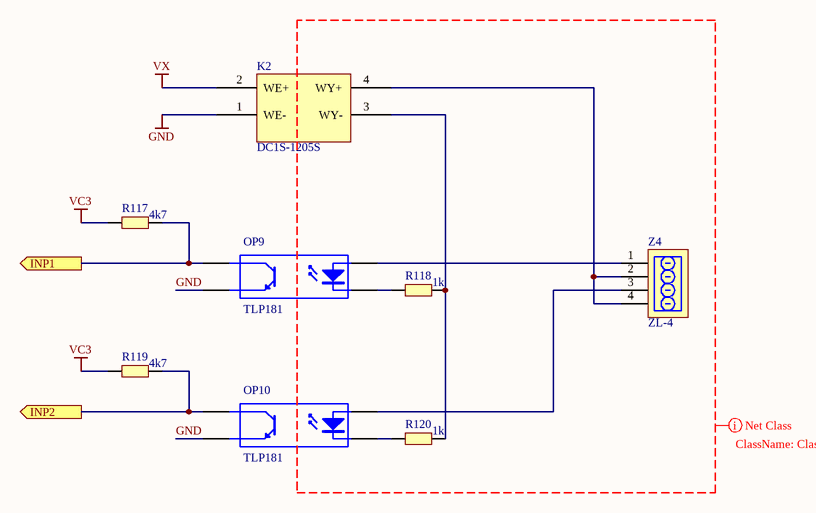
[diagram p7: Inp.SchDoc]

### Parts
K2  DC1S-1205S  [DCDC_SIL4]
OP9  TLP181  [TLP181_1]
OP10  TLP181  [TLP181_1]
R117  4k7  [0603R]
R118  1k  [0805R]
R119  4k7  [0603R]
R120  1k  [0805R]
Z4  ZL-4  [ARC-4-3.5-TYCO-1]

### Ports
INP1 (out), INP2 (out)

### Nets
GND: K2.1(WE-) OP9.3 OP10.3
VC3: R117.2 R119.2
VX: K2.2(WE+)
INP1: OP9.4 R117.1 ; port INP1
INP2: OP10.4 R119.1 ; port INP2
NetK2_3: K2.3(WY-) R118.1 R120.1
NetK2_4: K2.4(WY+) Z4.2 Z4.4
NetOP9_1: OP9.1 Z4.1
NetOP9_2: OP9.2 R118.2
NetOP10_1: OP10.1 Z4.3
NetOP10_2: OP10.2 R120.2

### Layout directives
net class Class_INP: (no net found under the mark)

### Library data of the parts
K2 = DCDC_AM1S
OP9 OP10 = TLP621: Optoisolator
R117-R120 = RES3

## Nets that join several sheets
GND: ATRACK_HOST_V1 (32 pins), Stabilizator (17 pins), Ethernet (18 pins), i2c (10 pins), Relays (9 pins), RS485 (C33.2 K1.2 U7.2 U7.8), Radio (8 pins), Inp (K2.1 OP9.3 OP10.3)
VC3: ATRACK_HOST_V1 (25 pins), Stabilizator (C45.2 U9.2), Ethernet (17 pins), i2c (7 pins), RS485 (C33.1 U7.1 U7.7), Radio (5 pins), Inp (R117.2 R119.2)
VC5: ATRACK_HOST_V1 (BUZZER1.1 Z2.2), Stabilizator (C44.2 L2.2 R111.1 U9.3)
VX: Stabilizator (5 pins), Relays (25 pins), RS485 (K1.1), Inp (K2.2)
CS_R: ATRACK_HOST_V1 (U1.88), Radio (M1.15 R40.1)
E_CRS_DV: ATRACK_HOST_V1 (U1.32), Ethernet (R31.1)
E_MDC: ATRACK_HOST_V1 (U1.16), Ethernet (U2.13)
E_MDIO: ATRACK_HOST_V1 (U1.25), Ethernet (R21.1 U2.12)
E_OSC: ATRACK_HOST_V1 (U1.67), Ethernet (R34.1)
E_REF_CLK: ATRACK_HOST_V1 (U1.24), Ethernet (R24.1 U2.14)
E_RST: ATRACK_HOST_V1 (U1.17), Ethernet (U2.15)
E_RXD0: ATRACK_HOST_V1 (U1.33), Ethernet (R28.1)
E_RXD1: ATRACK_HOST_V1 (U1.34), Ethernet (R29.1)
E_TX_EN: ATRACK_HOST_V1 (U1.48), Ethernet (U2.16)
E_TXD0: ATRACK_HOST_V1 (U1.51), Ethernet (U2.17)
E_TXD1: ATRACK_HOST_V1 (U1.52), Ethernet (U2.18)
INP1: ATRACK_HOST_V1 (U1.86), Inp (OP9.4 R117.1)
INP2: ATRACK_HOST_V1 (U1.87), Inp (OP10.4 R119.1)
INT_R: ATRACK_HOST_V1 (U1.7), Radio (M1.2 R41.2)
K_IRQ: ATRACK_HOST_V1 (U1.95), i2c (Z3.4)
MISO_R: ATRACK_HOST_V1 (U1.90), Radio (M1.13)
MOSI_R: ATRACK_HOST_V1 (U1.91), Radio (M1.14)
PK1_1: ATRACK_HOST_V1 (U1.96), Relays (R51.2)
PK2_1: ATRACK_HOST_V1 (U1.97), Relays (R49.2)
PK3_1: ATRACK_HOST_V1 (U1.98), Relays (R48.2)
PK4_1: ATRACK_HOST_V1 (U1.1), Relays (R47.2)
PK5_1: ATRACK_HOST_V1 (U1.2), Relays (R46.2)
PK6_1: ATRACK_HOST_V1 (U1.3), Relays (R45.2)
PK7_1: ATRACK_HOST_V1 (U1.4), Relays (R43.2)
PK8_1: ATRACK_HOST_V1 (U1.5), Relays (R42.2)
RESET_R: ATRACK_HOST_V1 (U1.8), Radio (M1.1)
RX48: ATRACK_HOST_V1 (U1.56), RS485 (U7.6)
SCK_R: ATRACK_HOST_V1 (U1.89), Radio (M1.12)
SCL: ATRACK_HOST_V1 (U1.92), i2c (R39.2 U3.6 U4.6 Z3.2)
SDA: ATRACK_HOST_V1 (U1.93), i2c (R38.2 U3.5 U4.5 Z3.3)
TX48: ATRACK_HOST_V1 (U1.55), RS485 (U7.4)
TX48_EN: ATRACK_HOST_V1 (U1.53), RS485 (U7.3)